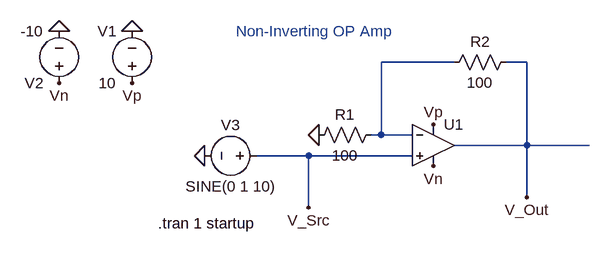
[diagram p0: schematic Non_Inverting_OP_Amp.asc]
Non_Inverting_OP_Amp.asc, the LTspice schematic file:
Version 4.1
SHEET 1 880 680
WIRE 192 32 80 32
WIRE 304 32 272 32
WIRE 80 144 80 32
WIRE 80 144 64 144
WIRE 128 144 80 144
WIRE 304 160 304 32
WIRE 304 160 192 160
WIRE 400 160 304 160
WIRE -32 176 -112 176
WIRE 128 176 -32 176
WIRE 304 240 304 160
WIRE -32 256 -32 176
FLAG -416 -16 0
FLAG -304 -16 0
FLAG 304 240 V_Out
FLAG -32 256 V_Src
FLAG -192 176 0
FLAG -16 144 0
FLAG -304 64 Vp
FLAG 160 128 Vp
FLAG 160 192 Vn
FLAG -416 64 Vn
SYMBOL voltage -416 80 R180
WINDOW 123 0 0 Left 0
WINDOW 39 0 0 Left 0
SYMATTR InstName V2
SYMATTR Value -10
SYMBOL res 288 16 R90
WINDOW 0 0 56 VBottom 2
WINDOW 3 32 56 VTop 2
SYMATTR InstName R2
SYMATTR Value 100
SYMBOL voltage -304 80 R180
WINDOW 0 24 96 Left 2
WINDOW 3 24 16 Left 2
WINDOW 123 0 0 Left 0
WINDOW 39 0 0 Left 0
SYMATTR InstName V1
SYMATTR Value 10
SYMBOL OpAmps\\UniversalOpAmp2 160 160 R0
SYMATTR InstName U1
SYMBOL voltage -96 176 R90
WINDOW 0 -32 56 VBottom 2
WINDOW 3 32 56 VTop 2
WINDOW 123 0 0 Left 0
WINDOW 39 0 0 Left 0
SYMATTR InstName V3
SYMATTR Value SINE(0 1 10)
SYMBOL res 80 128 R90
WINDOW 0 0 56 VBottom 2
WINDOW 3 32 56 VTop 2
SYMATTR InstName R1
SYMATTR Value 100
TEXT -264 280 Left 2 !.tran 1 startup
TEXT -144 -16 Left 2 ;Non-Inverting OP Amp

The netlist it stands for:
* Non_Inverting_OP_Amp.asc
V2 Vn 0 -10
R2 V_Out N001 100
V1 Vp 0 10
X§U1 V_Src N001 Vp Vn V_Out level2 Avol=1Meg GBW=10Meg Slew=10Meg Ilimit=25m Rail=0 Vos=0 En=0 Enk=0 In=0 Ink=0 Rin=500Meg  ; pins In+ In- V+ V- OUT
V3 V_Src 0 SINE(0 1 10)
R1 N001 0 100
.tran 1 startup
* Non-Inverting OP Amp
.lib UniversalOpAmp2.lib
.backanno
.end